# EAGLE schematic Clap operated system (EAGLE 9.1.3)
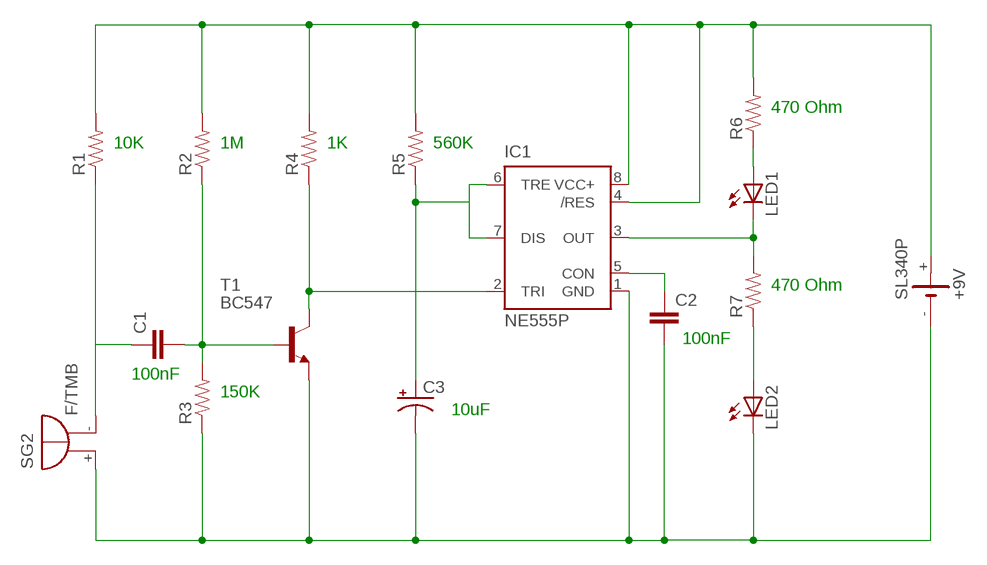
[diagram p0: schematic, sheet 1]

## Parts
+9V  SL340P  [SL-340/P3.6V]
C1  0.1UF-50V-20%(PTH)KIT-EZ  [CAP-PTH-SMALL-KIT]
C2  0.1UF-50V-20%(PTH)KIT-EZ  [CAP-PTH-SMALL-KIT]
C3  CAP_POLPTH1  [CPOL-RADIAL-100UF-25V]
IC1  NE555P  [DIL-08]
LED1  LED5MM  [LED5MM]
LED2  LED5MM  [LED5MM]
R1  10KOHM1/6W5%(PTH)KIT  [AXIAL-0.3-KIT]
R2  10KOHM1/6W5%(PTH)KIT  [AXIAL-0.3-KIT]
R3  10KOHM1/6W5%(PTH)KIT  [AXIAL-0.3-KIT]
R4  10KOHM1/6W5%(PTH)KIT  [AXIAL-0.3-KIT]
R5  10KOHM1/6W5%(PTH)KIT  [AXIAL-0.3-KIT]
R6  10KOHM1/6W5%(PTH)KIT  [AXIAL-0.3-KIT]
R7  10KOHM1/6W5%(PTH)KIT  [AXIAL-0.3-KIT]
SG2  F/TMB  [F/TMB]
T1  BC547  [TO92]

## Nets
N$1: C1.1 R1.P$1 SG2.-
N$2: C1.2 R2.P$1 R3.P$2 T1.2(B)
N$3: IC1.2(TRI) R4.P$1 T1.3(C)
N$4: C3.1(+) IC1.6(TRE) IC1.7(DIS) R5.P$1
N$5: C2.1 IC1.5(CON)
N$6: IC1.3(OUT) LED1.K(C) R7.P$2
N$7: LED2.A R7.P$1
N$8: +9V.+ IC1.4(/RES) IC1.8(VCC+) R1.P$2 R2.P$2 R4.P$2 R5.P$2 R6.P$2
N$9: LED1.A R6.P$1
N$10: +9V.- C2.2 C3.2(-) IC1.1(GND) LED2.K(C) R3.P$1 SG2.+ T1.1(E)

## Notes on the sheet
- 470 Ohm
- 10K | 1M | 1K | 560K
- 470 Ohm
- 100nF
- 100nF
- 150K
- 10uF

## Library data of the parts
+9V = battery:SL340P: LI BATTERY Sonnenschein SL-340 P 3.6 V
C1 C2 = SparkFun-Capacitors:0.1UF-50V-20%(PTH): CAP-08370; PROD_ID: CAP-08370
C3 = SparkFun-Capacitors:CAP_POL: Capacitor Polarized These are standard SMD and PTH capacitors. Normally 10uF, 47uF, and 100uF in electrolytic and tantalum varieties. Always verify the external diameter of the through hole cap, it varies with capacity, voltage, and manufacturer. The EIA devices should be standard.
IC1 = SparkFun-AnalogIC:NE555: General purpose bipolar Timer; MF: Arrow Electronics; MPN: NE555N; OC_FARNELL: 1467742; OC_NEWARK: 89K1486
LED1 LED2 = SparkFun-LED:LED: LEDs Standard schematic elements and footprints for 5mm, 3mm, 1206, and 0603 sized LEDs. 5mm - Spark Fun Electronics SKU : COM-00529 (and others)
R1-R7 = SparkFun-Resistors:10KOHM1/6W5%(PTH): RES-08375; PROD_ID: RES-08375
SG2 = buzzer:F/TMB: BUZZER Source: Buerklin; OC_FARNELL: unknown; OC_NEWARK: unknown
T1 = transistor:BC547: NPN TRANSISTOR